# Altium project PDM.PrjPCB
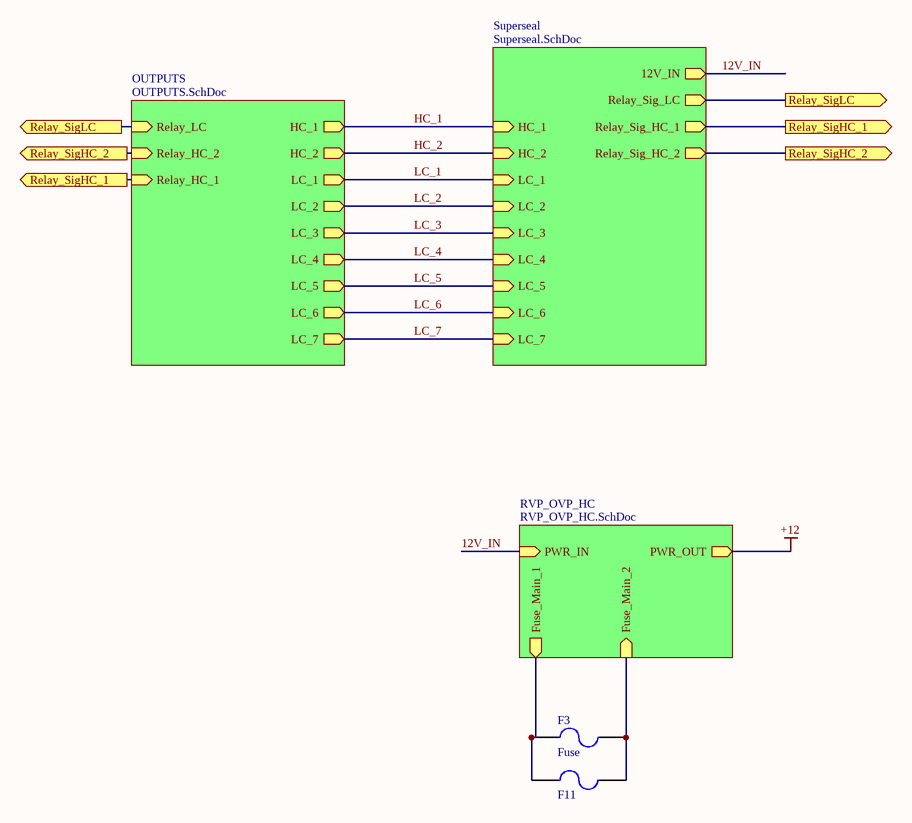
[diagram p0: PDM.SchDoc]
7 sheets, 63 parts. Net scope: hierarchical (ports join the sheet entries above them; power ports are global).
Board file: PDM_rev2.PcbDoc
Sheets:
  PDM.SchDoc
    OUTPUTS = OUTPUTS.SchDoc
      U_LC_OUTPUTS = LC_OUTPUTS.SchDoc
        5_Non-relay fused CKT = Non-relay fused CKT.SchDoc
        4_Non-relay fused CKT = Non-relay fused CKT.SchDoc
        3_Non-relay fused CKT = Non-relay fused CKT.SchDoc
        2_Non-relay fused CKT = Non-relay fused CKT.SchDoc
        1_Non-relay fused CKT = Non-relay fused CKT.SchDoc
        1_Non-relay fused CKT = Non-relay fused CKT.SchDoc
        LC_Relay fused CKT = Relay fused CKT.SchDoc
      U_HC_OUTPUTS = HC_OUTPUTS.SchDoc
        HC1_Relay fused CKT = Relay fused CKT.SchDoc
        HC2_Relay fused CKT = Relay fused CKT.SchDoc
    Superseal = Superseal.SchDoc

## Sheet PDM.SchDoc
size A

### Parts
(Parts that share a designator on the sheet are numbered #1, #2 ... from top to bottom, then left to right.)
F3#1  Fuse  [3568-MiniFuseHolder]
F11  Fuse  [3568-MiniFuseHolder]  (value not drawn)

### Sub-sheets
OUTPUTS = OUTPUTS.SchDoc: HC_1 (out), HC_2 (out), LC_1 (out), LC_2 (out), LC_3 (out), LC_4 (out), LC_5 (out), LC_6 (out), LC_7 (out), Relay_LC (in), Relay_HC_2 (in), Relay_HC_1 (in)
RVP_OVP_HC = RVP_OVP_HC.SchDoc (file not in this document): PWR_IN (in), Fuse_Main_1 (out), PWR_OUT (out), Fuse_Main_2 (in)
Superseal = Superseal.SchDoc: 12V_IN (out), LC_1 (in), LC_2 (in), LC_3 (in), LC_4 (in), LC_5 (in), LC_6 (in), LC_7 (in), Relay_Sig_LC (out), Relay_Sig_HC_1 (out), Relay_Sig_HC_2 (out), HC_2 (in), HC_1 (in)

### Ports
Relay_SigHC_1 (out), Relay_SigHC_2 (out), Relay_SigLC (out)

### Nets
12V_IN: sheet RVP_OVP_HC/PWR_IN, sheet Superseal/12V_IN
HC_1: sheet OUTPUTS/HC_1, sheet Superseal/HC_1
HC_2: sheet OUTPUTS/HC_2, sheet Superseal/HC_2
LC_1: sheet OUTPUTS/LC_1, sheet Superseal/LC_1
LC_2: sheet OUTPUTS/LC_2, sheet Superseal/LC_2
LC_3: sheet OUTPUTS/LC_3, sheet Superseal/LC_3
LC_4: sheet OUTPUTS/LC_4, sheet Superseal/LC_4
LC_5: sheet OUTPUTS/LC_5, sheet Superseal/LC_5
LC_6: sheet OUTPUTS/LC_6, sheet Superseal/LC_6
LC_7: sheet OUTPUTS/LC_7, sheet Superseal/LC_7
NetD8_2: port Relay_SigHC_1, sheet OUTPUTS/Relay_HC_1, sheet Superseal/Relay_Sig_HC_1
NetD10_2: port Relay_SigHC_2, sheet OUTPUTS/Relay_HC_2, sheet Superseal/Relay_Sig_HC_2
NetD12_2: port Relay_SigLC, sheet OUTPUTS/Relay_LC, sheet Superseal/Relay_Sig_LC
NetF3#1_1: F3#1.1 F11.1 ; sheet RVP_OVP_HC/Fuse_Main_1
NetF3#1_2: F3#1.2 F11.2 ; sheet RVP_OVP_HC/Fuse_Main_2

### Library data of the parts
F3#1 F11 = 3: Manufacturer_id: 1; idFuse: 3; Name: 3568 Mini Fuse Holder; Drawer_id: 1
  F11: Link: https://www.digikey.com/product-detail/en/keystone-electronics/3568/36-3568-ND/2137306

## Sheet OUTPUTS.SchDoc
size A
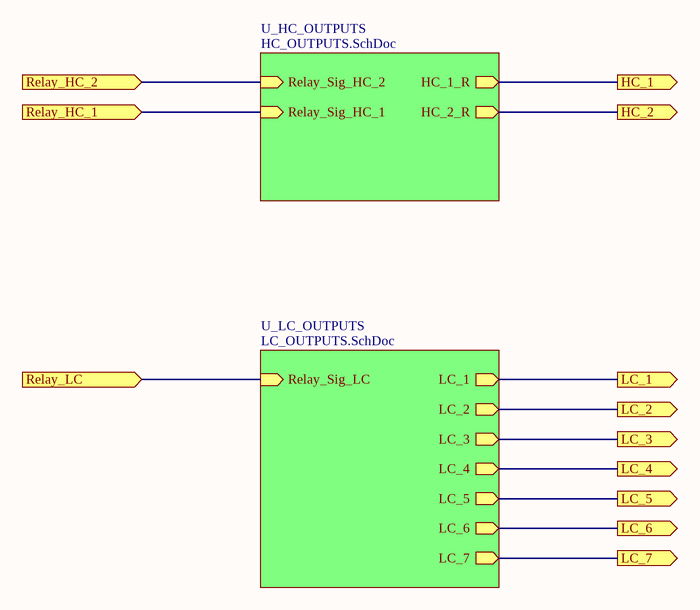
[diagram p1: OUTPUTS.SchDoc]

### Sub-sheets
U_HC_OUTPUTS = HC_OUTPUTS.SchDoc: Relay_Sig_HC_2 (in), Relay_Sig_HC_1 (in), HC_1_R (out), HC_2_R (out)
U_LC_OUTPUTS = LC_OUTPUTS.SchDoc: LC_1 (out), LC_2 (out), LC_3 (out), LC_4 (out), LC_5 (out), LC_6 (out), LC_7 (out), Relay_Sig_LC (in)

### Ports
HC_1 (out), HC_2 (out), LC_1 (out), LC_2 (out), LC_3 (out), LC_4 (out), LC_5 (out), LC_6 (out), LC_7 (out), Relay_HC_1 (in), Relay_HC_2 (in), Relay_LC (in)

### Nets
HC_1: port HC_1, sheet U_HC_OUTPUTS/HC_1_R
HC_2: port HC_2, sheet U_HC_OUTPUTS/HC_2_R
LC_1: port LC_1, sheet U_LC_OUTPUTS/LC_1
LC_2: port LC_2, sheet U_LC_OUTPUTS/LC_2
LC_3: port LC_3, sheet U_LC_OUTPUTS/LC_3
LC_4: port LC_4, sheet U_LC_OUTPUTS/LC_4
LC_5: port LC_5, sheet U_LC_OUTPUTS/LC_5
LC_6: port LC_6, sheet U_LC_OUTPUTS/LC_6
LC_7: port LC_7, sheet U_LC_OUTPUTS/LC_7
NetD8_2: port Relay_HC_1, sheet U_HC_OUTPUTS/Relay_Sig_HC_1
NetD10_2: port Relay_HC_2, sheet U_HC_OUTPUTS/Relay_Sig_HC_2
NetD12_2: port Relay_LC, sheet U_LC_OUTPUTS/Relay_Sig_LC

## Sheet LC_OUTPUTS.SchDoc
size A
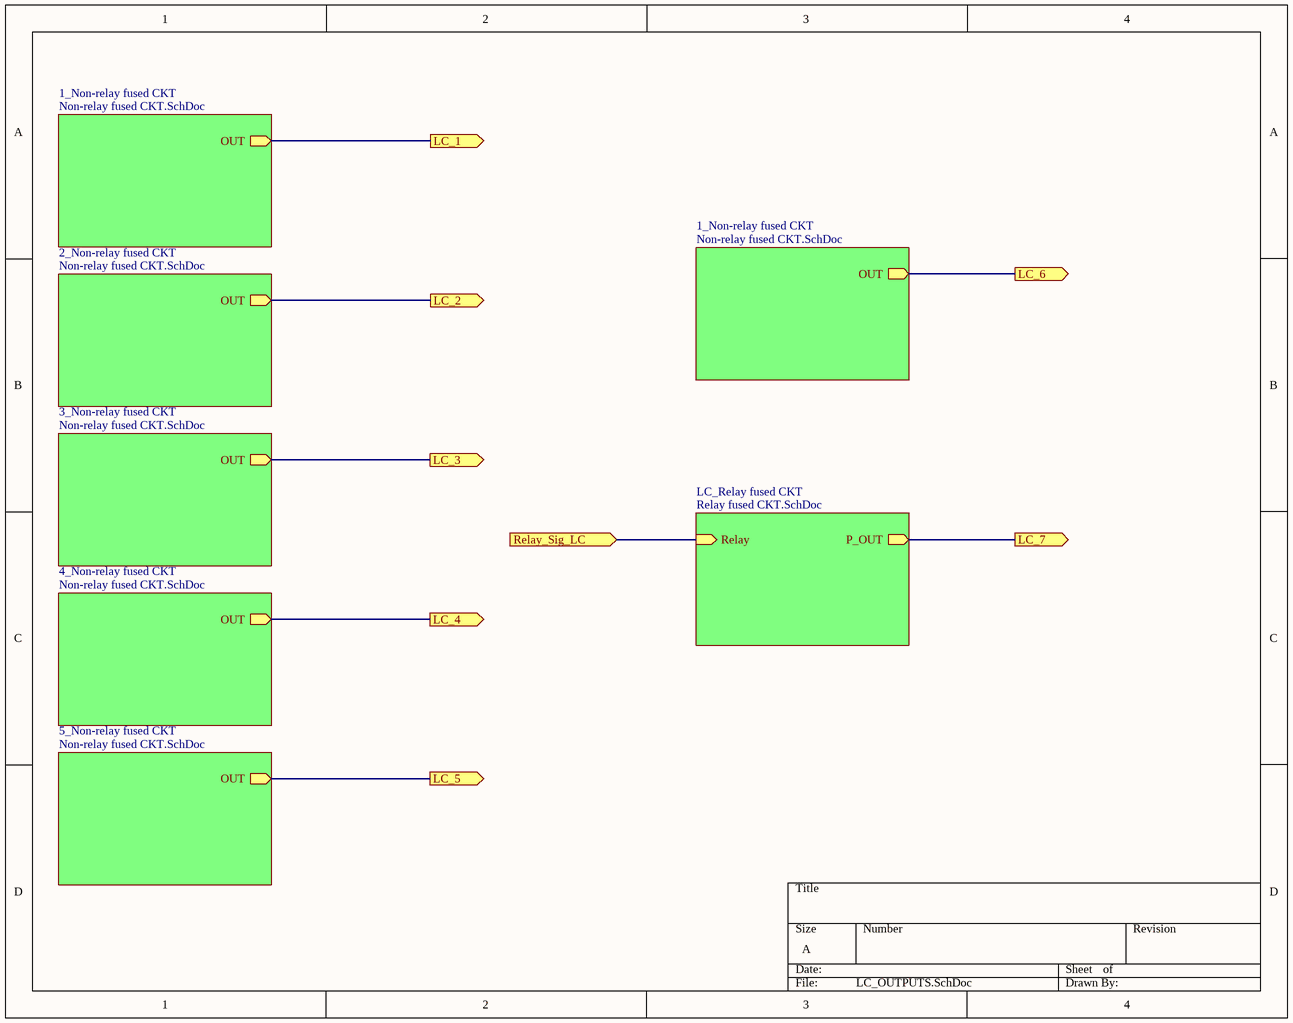
[diagram p2: LC_OUTPUTS.SchDoc]

### Sub-sheets
1_Non-relay fused CKT = Non-relay fused CKT.SchDoc: OUT (out)
1_Non-relay fused CKT = Non-relay fused CKT.SchDoc: OUT (out)
2_Non-relay fused CKT = Non-relay fused CKT.SchDoc: OUT (out)
3_Non-relay fused CKT = Non-relay fused CKT.SchDoc: OUT (out)
4_Non-relay fused CKT = Non-relay fused CKT.SchDoc: OUT (out)
5_Non-relay fused CKT = Non-relay fused CKT.SchDoc: OUT (out)
LC_Relay fused CKT = Relay fused CKT.SchDoc: P_OUT (out), Relay (in)

### Ports
LC_1 (out), LC_2 (out), LC_3 (out), LC_4 (out), LC_5 (out), LC_6 (out), LC_7 (out), Relay_Sig_LC (in)

### Nets
LC_1: port LC_1, sheet 1_Non-relay fused CKT/OUT
LC_2: port LC_2, sheet 2_Non-relay fused CKT/OUT
LC_3: port LC_3, sheet 3_Non-relay fused CKT/OUT
LC_4: port LC_4, sheet 4_Non-relay fused CKT/OUT
LC_5: port LC_5, sheet 5_Non-relay fused CKT/OUT
LC_6: port LC_6, sheet 1_Non-relay fused CKT/OUT
LC_7: port LC_7, sheet LC_Relay fused CKT/P_OUT
NetD12_2: port Relay_Sig_LC, sheet LC_Relay fused CKT/Relay

## Sheet Non-relay fused CKT.SchDoc
size A
Used 6 times, as channels OUTPUTS/U_LC_OUTPUTS/5_Non-relay fused CKT, OUTPUTS/U_LC_OUTPUTS/4_Non-relay fused CKT, OUTPUTS/U_LC_OUTPUTS/3_Non-relay fused CKT, OUTPUTS/U_LC_OUTPUTS/2_Non-relay fused CKT, OUTPUTS/U_LC_OUTPUTS/1_Non-relay fused CKT, OUTPUTS/U_LC_OUTPUTS/1_Non-relay fused CKT. Parts and nets are listed once, with the designators drawn on the sheet.
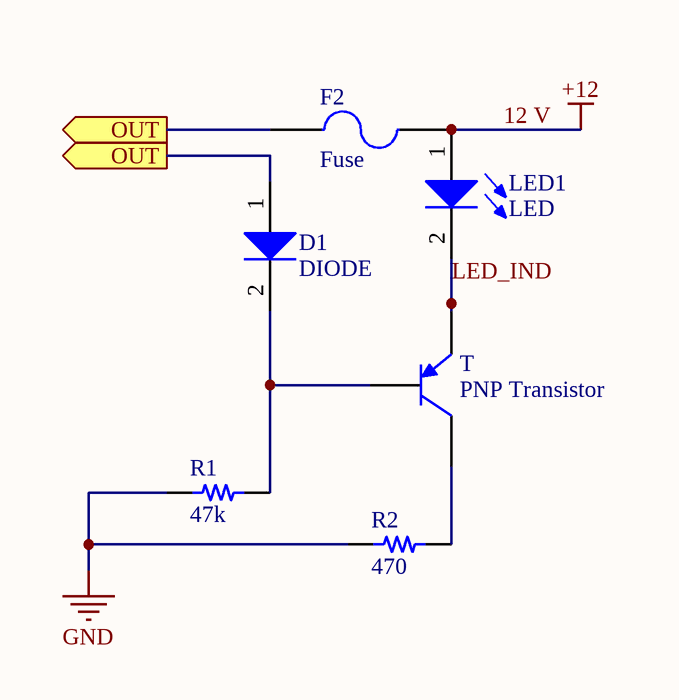
[diagram p3: Non-relay fused CKT.SchDoc]

### Parts
D1  DIODE  [SOD123F]
F2  Fuse  [3568-MiniFuseHolder]
LED1  LED  [0805_LED]
R1  value 47k  [RES 0805/2012]  (hidden comment: Resistor 47k 0805 1/10W 1%)
R2  value 470  [RES 0805/2012]  (hidden comment: Resistor 470 0805 1/10W 1%)
T  PNP Transistor  [SOT23-3]

### Ports
OUT (out)

### Nets
12 V: F2.2 LED1.1(A)  [also labelled +12]
GND: R1.2 R2.2
LED_IND: LED1.2(K) T.2(E)
OUT: D1.1(A) F2.1 ; port OUT
NetD1_2: D1.2(K) R1.1 T.1(B)
NetR2_1: R2.1 T.3(C)

### Channels
OUTPUTS/U_LC_OUTPUTS/5_Non-relay fused CKT: designators D1=D6 F2=F6 LED1=LED6 R1=R11 R2=R12 T=T6; ports OUT=LC_5
OUTPUTS/U_LC_OUTPUTS/4_Non-relay fused CKT: designators D1=D5 F2=F5 LED1=LED5 R1=R9 R2=R10 T=T5; ports OUT=LC_4
OUTPUTS/U_LC_OUTPUTS/3_Non-relay fused CKT: designators D1=D4 F2=F4 LED1=LED4 R1=R7 R2=R8 T=T4; ports OUT=LC_3
OUTPUTS/U_LC_OUTPUTS/2_Non-relay fused CKT: designators D1=D3 F2=F3#2 LED1=LED3 R1=R5 R2=R6 T=T3; ports OUT=LC_2
OUTPUTS/U_LC_OUTPUTS/1_Non-relay fused CKT: designators D1=D2 F2=F2 LED1=LED2 R1=R3 R2=R4 T=T2; ports OUT=LC_1
OUTPUTS/U_LC_OUTPUTS/1_Non-relay fused CKT: designators D1=D1 F2=F1 LED1=LED1 R1=R1 R2=R2 T=T1; ports OUT=LC_6

### Library data of the parts
D1 = 2: Diode Super Barrier 40V 1A Surface Mount SOD-123F; Manufacturer_id: 1; MfrPartNo: 1N5819HW1-7-F; idDiode: 2; Name: 1N5819; Drawer_id: 1; Value: 1A; Type: Super Barrier; Num_Circuits: 1; Ic: 1A; Power: 40V; Package: SOD-123; Link: https://www.digikey.com/product-detail/en/diodes-incorporated/1N5819HW1-7-F/1N5819HW1-7-FDITR-ND/5768523; ComponentLink1Description: Datasheet; ComponentLink1URL: https://www.diodes.com/assets/Datasheets/1N5819HW1.pdf; Supplier1: Digi-Key; Supplier1PartNo: 1N5819HW1-7-FDITR-ND
F2 = 3: as F3#1 on sheet PDM; Drawer_id: 1
LED1 = 1: idLED: 1; Name: LED_0805_RED; Value: Red; Vf: 0.7V; Manufacturer_id: 1; Drawer_id: 1; Package: 0805
R1 = 545: Manufacturer_id: 1; idResistor: 545; Name: Res_47k_0805_1/10W_1%; Created_By: Nick Mah; Supplier 1: Digi-Key; Drawer_id: 1; Tolerance: 1%; Power: 1/10W; Package: 0805; ComponentLink1Description: Datasheet; Created_Date: 2018-10-20
R2 = 497: Manufacturer_id: 1; idResistor: 497; Name: Res_470_0805_1/10W_1%; Created_By: Nick Mah; Supplier 1: Digi-Key; Drawer_id: 1; Tolerance: 1%; Power: 1/10W; Package: 0805; ComponentLink1Description: Datasheet; Created_Date: 2018-10-20
T = 3: Manufacturer_id: 1; idBJT: 3; Name: MMBT4403WT1G; Ic: 600mA; Vce(Max): -40V; Created_By: Angel; Drawer_id: 1; Type: PNP; Num_Circuits: 1; Package: SOT23-3; MfrPartNo: MMBT4403WT1G; Link: https://www.digikey.com/product-detail/en/on-semiconductor/MMBT4403WT1G/MMBT4403WT1GOSCT-ND/3487572

## Sheet Relay fused CKT.SchDoc
size A
Used 3 times, as channels OUTPUTS/U_LC_OUTPUTS/LC_Relay fused CKT, OUTPUTS/U_HC_OUTPUTS/HC1_Relay fused CKT, OUTPUTS/U_HC_OUTPUTS/HC2_Relay fused CKT. Parts and nets are listed once, with the designators drawn on the sheet.
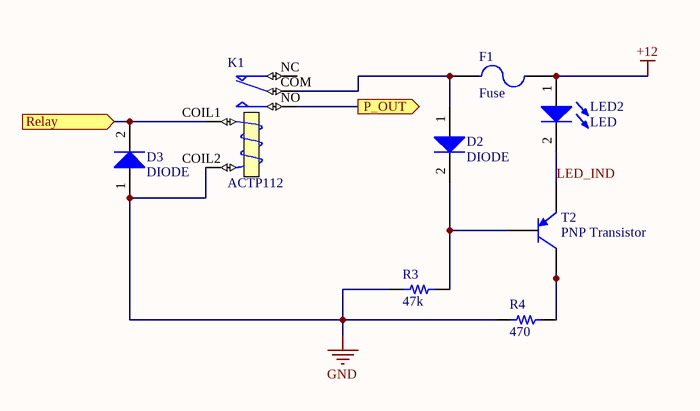
[diagram p4: Relay fused CKT.SchDoc]

### Parts
D2  DIODE  [SOD123F]
D3  DIODE  [SOD123F]
F1  Fuse  [3568-MiniFuseHolder]
K1  ACTP112  [ACTP112]
LED2  LED  [0805_LED]
R3  value 47k  [RES 0805/2012]  (hidden comment: Resistor 47k 0805 1/10W 1%)
R4  value 470  [RES 0805/2012]  (hidden comment: Resistor 470 0805 1/10W 1%)
T2  PNP Transistor  [SOT23-3]

### Ports
P_OUT (out), Relay (in)

### Nets
+12: F1.2 LED2.1(A)
GND: D3.1(A) K1.COIL2(T2) R3.2 R4.2
LED_IND: LED2.2(K) T2.2(E)
P_OUT: K1.NO ; port P_OUT
Relay: D3.2(K) K1.COIL1(T1) ; port Relay
NetD2_1: D2.1(A) F1.1 K1.COM
NetD2_2: D2.2(K) R3.1 T2.1(B)
NetR4_1: R4.1 T2.3(C)

Not connected (* = marked no-connect by the designer): K1 NC

### Channels
OUTPUTS/U_LC_OUTPUTS/LC_Relay fused CKT: designators D2=D11 D3=D12 F1=F10 K1=K3 LED2=LED9 R3=R17 R4=R18 T2=T9; ports P_OUT=LC_7 Relay=NetD12_2
OUTPUTS/U_HC_OUTPUTS/HC1_Relay fused CKT: designators D2=D7 D3=D8 F1=F8 K1=K1 LED2=LED7 R3=R13 R4=R14 T2=T7; ports P_OUT=HC_1 Relay=NetD8_2
OUTPUTS/U_HC_OUTPUTS/HC2_Relay fused CKT: designators D2=D9 D3=D10 F1=F9 K1=K2 LED2=LED8 R3=R15 R4=R16 T2=T8; ports P_OUT=HC_2 Relay=NetD10_2

### Library data of the parts
D2 D3 = 2: as D1 on sheet Non-relay fused CKT; Drawer_id: 1; Value: 1A; Type: Super Barrier; Num_Circuits: 1; Ic: 1A; Power: 40V; Package: SOD-123; Link: https://www.digikey.com/product-detail/en/diodes-incorporated/1N5819HW1-7-F/1N5819HW1-7-FDITR-ND/5768523; ComponentLink1Description: Datasheet; ComponentLink1URL: https://www.diodes.com/assets/Datasheets/1N5819HW1.pdf; Supplier1: Digi-Key; Supplier1PartNo: 1N5819HW1-7-FDITR-ND
F1 = 3: as F3#1 on sheet PDM; Drawer_id: 1
K1 = 3: Manufacturer_id: 1; idRelay: 3; Coil_Voltage: 12V; Published: 8-Jun-2000; LatestRevisionDate: 17-Jul-2002; LatestRevisionNote: Re-released for DXP Platform.; PackageReference: MODULE5B; Publisher: Altium Limited; Drawer_id: 1; Name: ACTP112
LED2 = 1: as LED1 on sheet Non-relay fused CKT; Manufacturer_id: 1; Drawer_id: 1; Package: 0805
R3 = 545: as R1 on sheet Non-relay fused CKT; Supplier 1: Digi-Key; Drawer_id: 1; Tolerance: 1%; Power: 1/10W; Package: 0805; ComponentLink1Description: Datasheet; Created_Date: 2018-10-20
R4 = 497: as R2 on sheet Non-relay fused CKT; Supplier 1: Digi-Key; Drawer_id: 1; Tolerance: 1%; Power: 1/10W; Package: 0805; ComponentLink1Description: Datasheet; Created_Date: 2018-10-20
T2 = 3: as T on sheet Non-relay fused CKT; Drawer_id: 1; Type: PNP; Num_Circuits: 1; Package: SOT23-3; MfrPartNo: MMBT4403WT1G; Link: https://www.digikey.com/product-detail/en/on-semiconductor/MMBT4403WT1G/MMBT4403WT1GOSCT-ND/3487572

## Sheet HC_OUTPUTS.SchDoc
size A
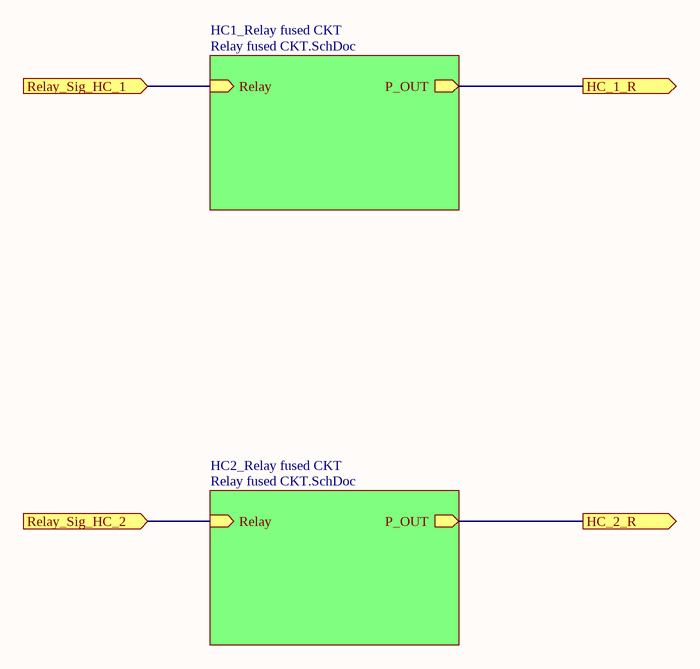
[diagram p5: HC_OUTPUTS.SchDoc]

### Sub-sheets
HC1_Relay fused CKT = Relay fused CKT.SchDoc: P_OUT (out), Relay (in)
HC2_Relay fused CKT = Relay fused CKT.SchDoc: P_OUT (out), Relay (in)

### Ports
HC_1_R (out), HC_2_R (out), Relay_Sig_HC_1 (in), Relay_Sig_HC_2 (in)

### Nets
HC_1: port HC_1_R, sheet HC1_Relay fused CKT/P_OUT
HC_2: port HC_2_R, sheet HC2_Relay fused CKT/P_OUT
NetD8_2: port Relay_Sig_HC_1, sheet HC1_Relay fused CKT/Relay
NetD10_2: port Relay_Sig_HC_2, sheet HC2_Relay fused CKT/Relay

## Sheet Superseal.SchDoc
size A
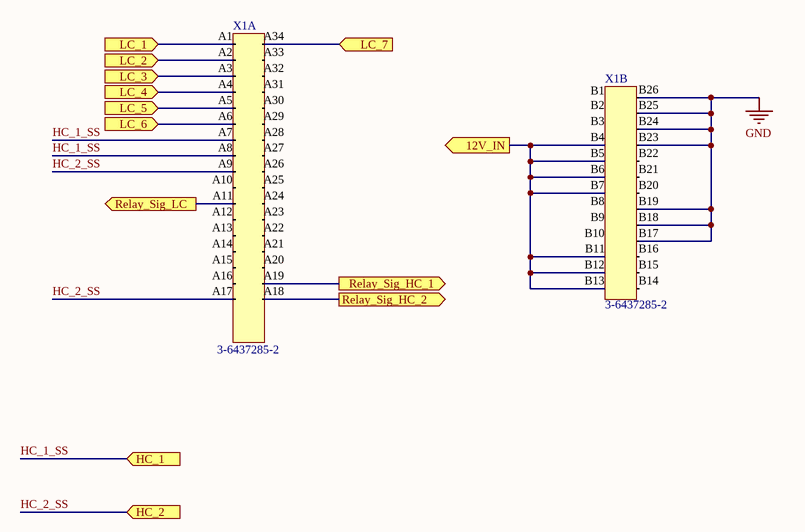
[diagram p6: Superseal.SchDoc]

### Parts
X1  3-6437285-2  [SUPERSEAL 60POS 90Deg]  (parts A,B of 2)

### Ports
12V_IN (out), HC_1 (in), HC_2 (in), LC_1 (in), LC_2 (in), LC_3 (in), LC_4 (in), LC_5 (in), LC_6 (in), LC_7 (in), Relay_Sig_HC_1 (out), Relay_Sig_HC_2 (out), Relay_Sig_LC (out)

### Nets
GND: X1.B17 X1.B18 X1.B19 X1.B23 X1.B24 X1.B25 X1.B26
12V_IN: X1.B4 X1.B5 X1.B6 X1.B7 X1.B11 X1.B12 X1.B13 ; port 12V_IN
HC_1_SS: X1.A7 X1.A8 ; port HC_1  [project net HC_1]
HC_2_SS: X1.A9 X1.A17 ; port HC_2  [project net HC_2]
LC_1: X1.A1 ; port LC_1
LC_2: X1.A2 ; port LC_2
LC_3: X1.A3 ; port LC_3
LC_4: X1.A4 ; port LC_4
LC_5: X1.A5 ; port LC_5
LC_6: X1.A6 ; port LC_6
LC_7: X1.A34 ; port LC_7
NetD8_2: X1.A19 ; port Relay_Sig_HC_1
NetD10_2: X1.A18 ; port Relay_Sig_HC_2
NetD12_2: X1.A11 ; port Relay_Sig_LC

Not connected (* = marked no-connect by the designer): X1 A10 A12 A13 A14 A15 A16 A20 A21 A22 A23 A24 A25 A26 A27 A28 A29 A30 A31 A32 A33 B1 B2 B3 B8 B9 B10 B14 B15 B16 B20 B21 B22

### Library data of the parts
X1 = 3: 90 Degree; Manufacturer_id: 1; idConn: 3; Name: AMP Superseal 60POS 90Deg; Value: CONN; Num_Contacts: 60; Num_Rows: 4; Pitch: 3 mm; MfrPartNo: 3-6437285-2; Drawer_id: 1; Link: https://www.te.com/usa-en/product-3-6437285-2.html; ComponentLink1Description: Datasheet

## Nets that join several sheets
12 V: OUTPUTS/U_LC_OUTPUTS/5_Non-relay fused CKT (F6.2 LED6.1), OUTPUTS/U_LC_OUTPUTS/4_Non-relay fused CKT (F5.2 LED5.1), OUTPUTS/U_LC_OUTPUTS/3_Non-relay fused CKT (F4.2 LED4.1), OUTPUTS/U_LC_OUTPUTS/2_Non-relay fused CKT (F3#2.2 LED3.1), OUTPUTS/U_LC_OUTPUTS/1_Non-relay fused CKT (F2.2 LED2.1), OUTPUTS/U_LC_OUTPUTS/1_Non-relay fused CKT (F1.2 LED1.1), OUTPUTS/U_LC_OUTPUTS/LC_Relay fused CKT (F10.2 LED9.1), OUTPUTS/U_HC_OUTPUTS/HC1_Relay fused CKT (F8.2 LED7.1), OUTPUTS/U_HC_OUTPUTS/HC2_Relay fused CKT (F9.2 LED8.1)
GND: OUTPUTS/U_LC_OUTPUTS/5_Non-relay fused CKT (R11.2 R12.2), OUTPUTS/U_LC_OUTPUTS/4_Non-relay fused CKT (R9.2 R10.2), OUTPUTS/U_LC_OUTPUTS/3_Non-relay fused CKT (R7.2 R8.2), OUTPUTS/U_LC_OUTPUTS/2_Non-relay fused CKT (R5.2 R6.2), OUTPUTS/U_LC_OUTPUTS/1_Non-relay fused CKT (R3.2 R4.2), OUTPUTS/U_LC_OUTPUTS/1_Non-relay fused CKT (R1.2 R2.2), OUTPUTS/U_LC_OUTPUTS/LC_Relay fused CKT (D12.1 K3.COIL2 R17.2 R18.2), OUTPUTS/U_HC_OUTPUTS/HC1_Relay fused CKT (D8.1 K1.COIL2 R13.2 R14.2), OUTPUTS/U_HC_OUTPUTS/HC2_Relay fused CKT (D10.1 K2.COIL2 R15.2 R16.2), Superseal (7 pins)
HC_1: OUTPUTS/U_HC_OUTPUTS/HC1_Relay fused CKT (K1.NO), Superseal (X1.A7 X1.A8)
HC_2: OUTPUTS/U_HC_OUTPUTS/HC2_Relay fused CKT (K2.NO), Superseal (X1.A9 X1.A17)
LC_1: OUTPUTS/U_LC_OUTPUTS/1_Non-relay fused CKT (D2.1 F2.1), Superseal (X1.A1)
LC_2: OUTPUTS/U_LC_OUTPUTS/2_Non-relay fused CKT (D3.1 F3#2.1), Superseal (X1.A2)
LC_3: OUTPUTS/U_LC_OUTPUTS/3_Non-relay fused CKT (D4.1 F4.1), Superseal (X1.A3)
LC_4: OUTPUTS/U_LC_OUTPUTS/4_Non-relay fused CKT (D5.1 F5.1), Superseal (X1.A4)
LC_5: OUTPUTS/U_LC_OUTPUTS/5_Non-relay fused CKT (D6.1 F6.1), Superseal (X1.A5)
LC_6: OUTPUTS/U_LC_OUTPUTS/1_Non-relay fused CKT (D1.1 F1.1), Superseal (X1.A6)
LC_7: OUTPUTS/U_LC_OUTPUTS/LC_Relay fused CKT (K3.NO), Superseal (X1.A34)
NetD8_2: OUTPUTS/U_HC_OUTPUTS/HC1_Relay fused CKT (D8.2 K1.COIL1), Superseal (X1.A19)
NetD10_2: OUTPUTS/U_HC_OUTPUTS/HC2_Relay fused CKT (D10.2 K2.COIL1), Superseal (X1.A18)
NetD12_2: OUTPUTS/U_LC_OUTPUTS/LC_Relay fused CKT (D12.2 K3.COIL1), Superseal (X1.A11)